# Altium schematic sheet Sheet1.SchDoc
size 594 x 420 mm; SheetNumber: 1; SheetTotal: 1
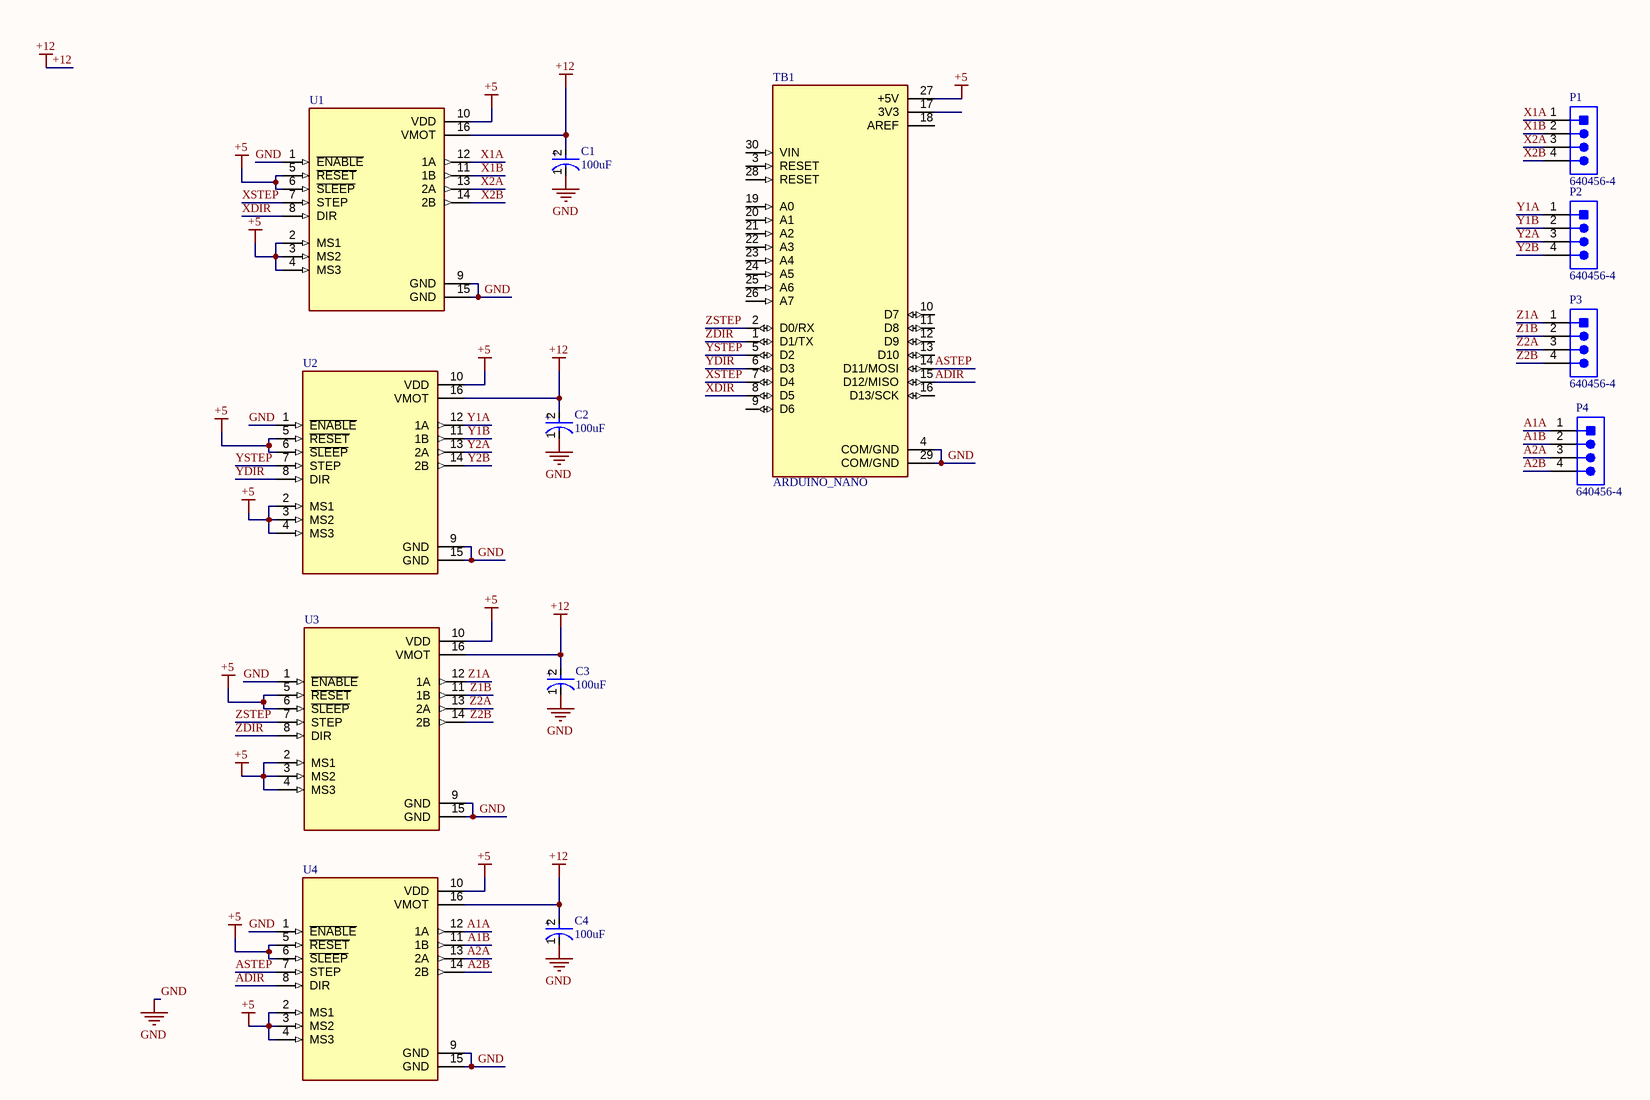
[diagram p0: Sheet1.SchDoc]

## Parts
C1  100uF  [FP-RAD-TH-D_18_0_5-L_40_2-MFG]
C2  100uF  [FP-RAD-TH-D_18_0_5-L_40_2-MFG]
C3  100uF  [FP-RAD-TH-D_18_0_5-L_40_2-MFG]
C4  100uF  [FP-RAD-TH-D_18_0_5-L_40_2-MFG]
P1  640456-4  [TECO-640456-4]
P2  640456-4  [TECO-640456-4]
P3  640456-4  [TECO-640456-4]
P4  640456-4  [TECO-640456-4]
TB1  ARDUINO_NANO  [SHIELD_ARDUINO_NANO]
U1  A4988_STEPPER_MOTOR_DRIVER_CARRIER_BLACK  [MODULE_A4988_STEPPER_MOTOR_DRIVER_CARRIER_BLACK]  (value not drawn)
U2  4988_STEPPER_MOTOR_DRIVER_CARRIER_BLACK  [MODULE_A4988_STEPPER_MOTOR_DRIVER_CARRIER_BLACK]  (value not drawn)
U3  A4988_STEPPER_MOTOR_DRIVER_CARRIER_BLACK  [MODULE_A4988_STEPPER_MOTOR_DRIVER_CARRIER_BLACK]  (value not drawn)
U4  A4988_STEPPER_MOTOR_DRIVER_CARRIER_BLACK  [MODULE_A4988_STEPPER_MOTOR_DRIVER_CARRIER_BLACK]  (value not drawn)

## Nets
+5: TB1.27(+5V) U1.2(MS1) U1.3(MS2) U1.4(MS3) U1.5(~{RESET}) U1.6(~{SLEEP}) U1.10(VDD) U2.2(MS1) U2.3(MS2) U2.4(MS3) U2.5(~{RESET}) U2.6(~{SLEEP}) U2.10(VDD) U3.2(MS1) U3.3(MS2) U3.4(MS3) U3.5(~{RESET}) U3.6(~{SLEEP}) U3.10(VDD) U4.2(MS1) U4.3(MS2) U4.4(MS3) U4.5(~{RESET}) U4.6(~{SLEEP}) U4.10(VDD)
+12: C1.2(A) C2.2(A) C3.2(A) C4.2(A) U1.16(VMOT) U2.16(VMOT) U3.16(VMOT) U4.16(VMOT)
GND: C1.1(C) C2.1(C) C3.1(C) C4.1(C) TB1.4(COM/GND) TB1.29(COM/GND) U1.1(~{ENABLE}) U1.9(GND) U1.15(GND) U2.1(~{ENABLE}) U2.9(GND) U2.15(GND) U3.1(~{ENABLE}) U3.9(GND) U3.15(GND) U4.1(~{ENABLE}) U4.9(GND) U4.15(GND)
A1A: P4.1 U4.12(1A)
A1B: P4.2 U4.11(1B)
A2A: P4.3 U4.13(2A)
A2B: P4.4 U4.14(2B)
ADIR: TB1.15(D12/MISO) U4.8(DIR)
ASTEP: TB1.14(D11/MOSI) U4.7(STEP)
X1A: P1.1 U1.12(1A)
X1B: P1.2 U1.11(1B)
X2A: P1.3 U1.13(2A)
X2B: P1.4 U1.14(2B)
XDIR: TB1.8(D5) U1.8(DIR)
XSTEP: TB1.7(D4) U1.7(STEP)
Y1A: P2.1 U2.12(1A)
Y1B: P2.2 U2.11(1B)
Y2A: P2.3 U2.13(2A)
Y2B: P2.4 U2.14(2B)
YDIR: TB1.6(D3) U2.8(DIR)
YSTEP: TB1.5(D2) U2.7(STEP)
Z1A: P3.1 U3.12(1A)
Z1B: P3.2 U3.11(1B)
Z2A: P3.3 U3.13(2A)
Z2B: P3.4 U3.14(2B)
ZDIR: TB1.1(D1/TX) U3.8(DIR)
ZSTEP: TB1.2(D0/RX) U3.7(STEP)

Not connected (* = marked no-connect by the designer): TB1 3(RESET) 9(D6) 10(D7) 11(D8) 12(D9) 13(D10) 16(D13/SCK) 17(3V3) 18(AREF) 19(A0) 20(A1) 21(A2) 22(A3) 23(A4) 24(A5) 25(A6) 26(A7) 28(RESET) 30(VIN)

## Notes on the sheet
- DWG NO:
- REV:
- THIS DOCUMENT AND THE DATA DISCLOSED HEREIN OR
- HEREWITH IS THE PROPERTY OF ALTIUM LIMITED AND MAY
- BE FREELY DISTRIBUTED IN WHOLE. NO RIGHTS ARE
- RESERVED OR EXPRESS OR IMPLIED WARANTEE GIVEN.
- REVISION
- DESCRIPTION
- DATE
- APPROVED
- ENG:
- APPROVALS
- PROJECT
- DSN:
- CHK:
- REFERENCE DOCUMENTS
- PROJECT REVISION:
- TITLE
- DOCUMENT REVISION:
- DESIGN ITEM:
- BOM:
- FAB DWG:
- PCB DWG:
- ASSY DWG:
- SCALE:
- A2
- SIZE
- CAGE CODE
- FILE NAME
- DWG NO.
- SHEET
- OF
- REV
- (in symbol CMP-05427-001087-1) +

## Library data of the parts
C1-C3 = CMP-05427-001087-1: Aluminum Electrolytic Capacitors (Radial Lead Type) 100uF ±20% 400V; Polarity: Polar; Lead Diameter: 0.8mm; Ripple Current: 2.06A; Leakage Current: 2.41mA; Dissipation Factor: 0.24%; Life (Hours): 10000Hour; Package Quantity: 50; Mount: Through Hole; RoHS Compliant: Yes; Lead Pitch: 7.5mm; Voltage Rating (DC): 400V; Number of Pins: 2; Ripple Current (AC): 2.06A; Radiation Hardening: No; Max Operating Temperature: 105°C; Height - Seated (Max): 1.654inch; Length: 40mm; Height: 40mm; Termination: Radial; Voltage: 400V; Construction: RADIAL; Diameter: 18mm; Case/Package: Radial; REACH SVHC: No SVHC; Series: EE; Capacitance: 100uF; Packaging: Bulk; Voltage Rating: 400V; Lead Free: Lead Free; Tolerance: 20%; Min Operating Temperature: -25°C
C4 = CMP-05427-001087-1: Polarity: Polar; Lead Diameter: 0.8mm; Voltage Rating (DC): 400V; Ripple Current: 2.06A; Leakage Current: 2.41mA; Dissipation Factor: 0.24%; Life (Hours): 10000Hour; Tolerance: 20%; Package Quantity: 50; Mount: Through Hole; RoHS Compliant: Yes; Lead Pitch: 7.5mm; Number of Pins: 2; Ripple Current (AC): 2.06A; Radiation Hardening: No; Max Operating Temperature: 105°C; Height - Seated (Max): 1.654inch; Length: 40mm; Height: 40mm; Termination: Radial; Voltage: 400V; Construction: RADIAL; Diameter: 18mm; Case/Package: Radial; REACH SVHC: No SVHC; Series: EE; Capacitance: 100uF; Packaging: Bulk; Voltage Rating: 400V; Lead Free: Lead Free; Min Operating Temperature: -25°C
P1-P4 = CMP-2000-05419-1: Male Header, Pitch 2.54 mm, 1 x 4 Position, Height 10.03 mm, Tail Length 3.56 mm, RoHS, Bulk; Manufacturer: TE Connectivity; Material, Housing: Polyester; Primary Type: InterconnectSystem; Mount Angle: Vertical; Color, Housing: White; Current, Rating: 5 / A; Agency Approvals: CSA,UL; Contact Termination Area Plating: Tin; Temperature, Operating: -55to+105 / degC; Standards: RoHSCompliant,ELVCompliant,UL94V-0; Number of Positions: 4; Brand/Series: MTA-100Series; Angle: Straight; Pin Spacing: 0.1 / "; Material, Contact: CopperAlloy; Connector Type: MTA-100; Special Features: Pinstrip; Mounting Hole Size: 0.04 / "; Contact Centerline Spacing: 0.100 / in.; Voltage, Rating: 250 / V; Manufacturer URL: http://www.te.com/; Length, Pin: 0.14 / "; Length, Overall: 0.4 / "; Color: White; Flammability Rating: UL94V-0; Mounting Type: PCMount; Termination: Solder; Datasheet URL: https://datasheet.ciiva.com/16286/eng-ds-82056-mta-0608-16286228.pdf; Number of Contacts: 4; Contact Shape: Square; Contact Mating Area Plating: Tin; Length, Terminal Post: 0.14 / in.; Size, Post: 0.025 / in.; Contact Plating: Tin; Type: PCBPlug; Datasheet Version: Dec-14; Number of Rows: 1
TB1 = ARDUINO_NANO: Small, complete, and breadboard-friendly board based on the ATmega328 (Arduino Nano 3.x); Check_prices: https://www.snapeda.com/parts/Arduino%20Nano/Arduino/view-part/?ref=eda; Value: *; Availability: Not in stock; MP: Arduino Nano; Price: None; Package: Non-Standard Arduino; SnapEDA_Link: https://www.snapeda.com/parts/Arduino%20Nano/Arduino/view-part/?ref=snap; MF: Arduino
U1-U4 = A4988_STEPPER_MOTOR_DRIVER_CARRIER_BLACK: MF: Pololu; MP: A4988 STEPPER MOTOR DRIVER CARRIER BLACK; SnapEDA_Link: https://www.snapeda.com/parts/A4988%20STEPPER%20MOTOR%20DRIVER%20CARRIER%20BLACK/Pololu/view-part/1450050/?ref=snap; Value: *; Availability: Unavailable; Price: None; Package: None
  U3: BuyPart: https://www.snapeda.com/parts/A4988%20STEPPER%20MOTOR%20DRIVER%20CARRIER%20BLACK/Pololu/view-part/1450050/?ref=eda